# Altium schematic sheet Elreg_Sender_CH2.SchDoc
size A
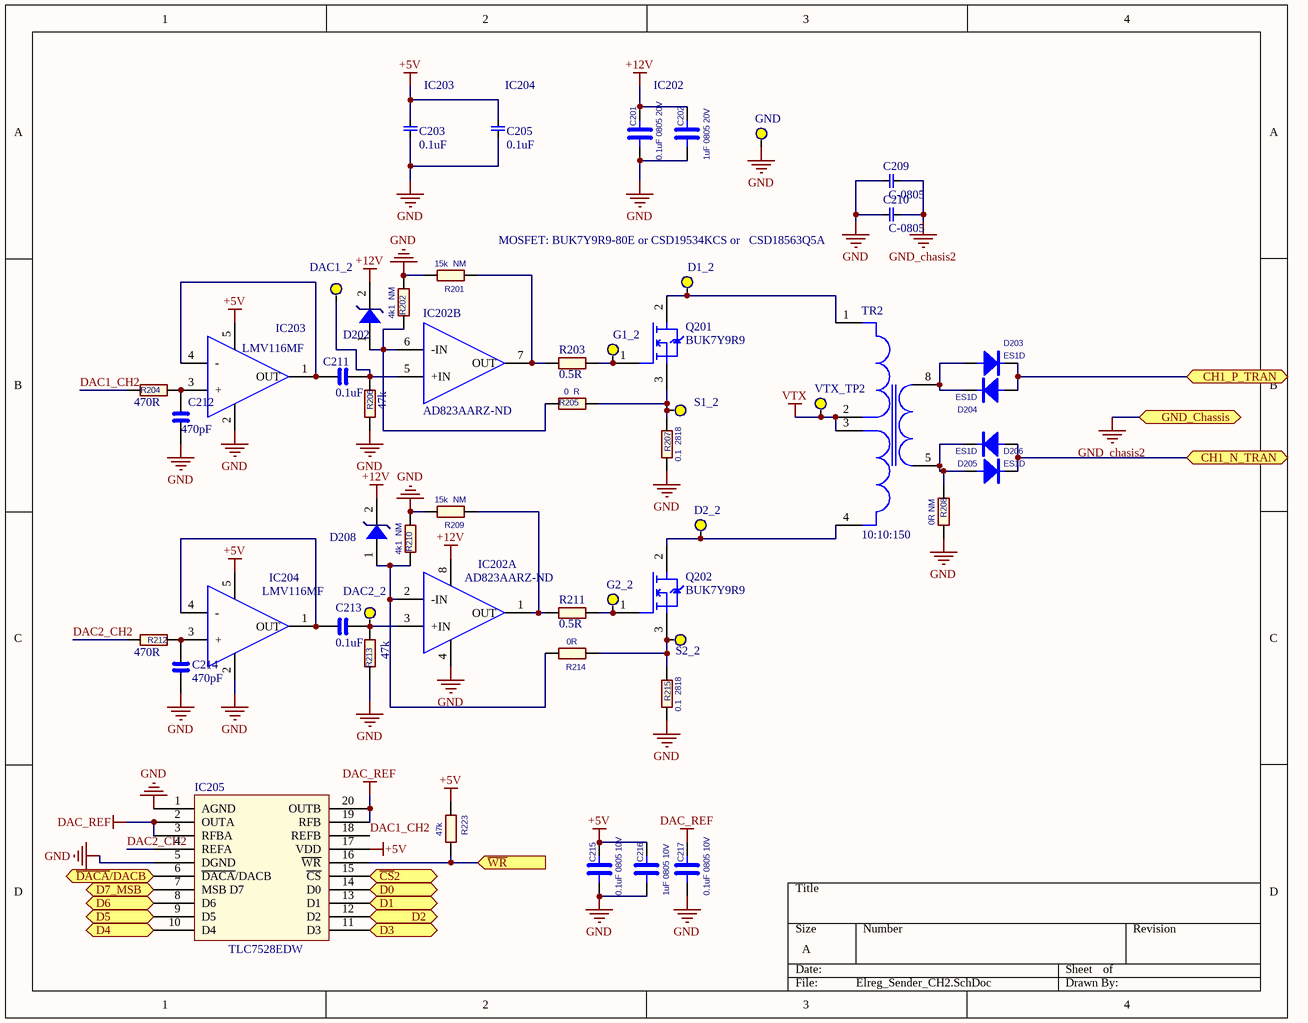
[diagram p0: Elreg_Sender_CH2.SchDoc]

## Parts
C201  0.1uF 0805 20V  [C-0603]
C202  1uF 0805 20V  [C-0603]
C203  0.1uF  [C-0603]
C205  0.1uF  [C-0603]
C209  C-0805  [C-0805]
C210  C-0805  [C-0805]
C211  0.1uF  [C-0603]
C212  470pF  [C-0603]
C213  0.1uF  [C-0603]
C214  470pF  [C-0603]
C215  0.1uF 0805 10V  [C-0603]
C216  1uF 0805 10V  [C-0603]
C217  0.1uF 0805 10V  [C-0603]
D1_2  Test_Point  [Test_Point]  (value not drawn)
D2_2  Test_Point  [Test_Point]  (value not drawn)
D202  Zener 12V  [DFN380P520X45-2N]  (value not drawn)
D203  ES1D  [SMA]
D204  ES1D  [SMA]
D205  ES1D  [SMA]
D206  ES1D  [SMA]
D208  Zener 12V  [DFN380P520X45-2N]  (value not drawn)
DAC1_2  DAC2_2  [Test_Point]  (value not drawn)
DAC2_2  DAC2_2  [Test_Point]  (value not drawn)
G1_2  Test_Point  [Test_Point]  (value not drawn)
G2_2  Test_Point  [Test_Point]  (value not drawn)
IC202  AD823AARZ-ND  [TSOP65P280X110-8N]  (parts A,B of 2)
IC203  LMV116MF  [SOT-23-5]
IC204  LMV116MF  [SOT-23-5]
IC205  TLC7528EDW  [SOIC-20]
Q201  BUK7Y9R9  [BUK7Y9R)]
Q202  BUK7Y9R9  [BUK7Y9R)]
R201  15k  NM  [R-0603]
R202  4k1  NM  [R-0603]
R203  0.5R  [R-0603]
R204  470R  [R-0603]
R205  0  R  [R-0603]
R206  47k  [R-0603]
R207  0.1  2818  [RES2818]
R208  0R NM  [RES-0805]
R209  15k  NM  [R-0603]
R210  4k1  NM  [R-0603]
R211  0.5R  [R-0603]
R212  470R  [R-0603]
R213  47k  [R-0603]
R214  0R  [R-0603]
R215  0.1  2818  [RES2818]
R223  47k  [R-0603]
S1_2  Test_Point  [Test_Point]  (value not drawn)
S2_2  Test_Point  [Test_Point]  (value not drawn)
TP6  GND  [Test_Point]
TR2  10:10:150  [Trafo_15x15]
VTX_TP2  Test_Point  [Test_Point]  (value not drawn)

## Ports
CH1_N_TRAN (bidir), CH1_P_TRAN (bidir), D0 (in), D1 (in), D2 (in), D3 (in), D4 (in), D5 (in), D6 (in), D7_MSB (in), GND_Chassis (bidir), ~{CS}2 (in), ~{DACA}/DACB (in), ~{WR} (in)

## Nets
+5V: C203.2(G) C205.2(G) C215.2 C216.2 IC203.5(+Vs) IC204.5(+Vs) IC205.17(VDD) R223.2
+12V: C201.2 C202.2 D202.2(A) D208.2(A) IC202.8(+Vs)
DAC_REF: C217.2 IC205.2(OUTA) IC205.3(RFBA) IC205.19(RFB) IC205.20(OUTB)
GND: C201.1 C202.1 C203.1(G) C205.1(G) C209.1(G) C210.1(G) C212.2 C214.1 C215.1 C216.1 C217.1 IC202.4(-Vs) IC203.2(-Vs) IC204.2(-Vs) IC205.1(AGND) IC205.5(DGND) R201.1 R202.2 R206.1 R207.2 R208.1 R209.1 R210.2 R213.2 R215.2 TP6.1
GND_chasis2: C209.2(G) C210.2(G) ; port GND_Chassis
VTX: TR2.2(G) TR2.3(G) VTX_TP2.1
~{CS}2: IC205.15(~{CS}) ; port ~{CS}2
~{DACA}/DACB: IC205.6(~{DACA}/DACB) ; port ~{DACA}/DACB
~{WR}: IC205.16(~{WR}) R223.1 ; port ~{WR}
CH1_N_TRAN: D205.1(A) D206.2(C) ; port CH1_N_TRAN
CH1_P_TRAN: D203.2(C) D204.1(A) ; port CH1_P_TRAN
D0: IC205.14(D0) ; port D0
D1: IC205.13(D1) ; port D1
D2: IC205.12(D2) ; port D2
D3: IC205.11(D3) ; port D3
D4: IC205.10(D4) ; port D4
D5: IC205.9(D5) ; port D5
D6: IC205.8(D6) ; port D6
D7_MSB: IC205.7(MSB_D7) ; port D7_MSB
DAC1_CH2: IC205.18(REFB) R204.1
DAC2_CH2: IC205.4(REFA) R212.1
NetC211_1: C211.1 DAC1_2.1 IC202.5(+IN) R206.2
NetC211_2: C211.2 IC203.1(OUT) IC203.4(-)
NetC212_1: C212.1 IC203.3(+) R204.2
NetC213_1: C213.1 DAC2_2.1 IC202.3(+IN) R213.1
NetC213_2: C213.2 IC204.1(OUT) IC204.4(-)
NetC214_2: C214.2 IC204.3(+) R212.2
NetD1_2_1: D1_2.1 Q201.2(G) TR2.1(G)
NetD2_2_1: D2_2.1 Q202.2(G) TR2.4(G)
NetD202_1: D202.1(A) IC202.6(-IN) R202.1 R205.1
NetD203_1: D203.1(A) D204.2(C) TR2.8(G)
NetD205_2: D205.2(C) D206.1(A) R208.2 TR2.5(G)
NetD208_1: D208.1(A) IC202.2(-IN) R210.1 R214.1
NetG1_2_1: G1_2.1 Q201.1(G) R203.2
NetG2_2_1: G2_2.1 Q202.1(G) R211.2
NetIC202_1: IC202.1(OUT) R209.2 R211.1
NetIC202_7: IC202.7(OUT) R201.2 R203.1
NetQ201_3: Q201.3(G) R205.2 R207.1 S1_2.1
NetQ202_3: Q202.3(G) R214.2 R215.1 S2_2.1

## Notes on the sheet
- IC203
- (near C205) IC204
- IC202
- MOSFET: BUK7Y9R9-80E or CSD19534KCS or   CSD18563Q5A

## Library data of the parts
C201 C202 C215-C217 = 0805CAPxxrrrrv: CAP CER rrrrUF xV x% type 0805
C203 C205 = C-0805_3_3uF: Manufacturer 1: Yageo; Manufacturer Part Number 1: CC1206KKX7RBBB332; Tolerance: ±10%; Voltage - Rated: 500V; Temperature Coefficient: X7R; Notification: Current market demand for these product types have resulted in fluctuating and extending lead times. Lead times may differ.; Description 1: CAP CER 3300PF 500V X7R 1206; Category 1: Capacitors; Packaging: Cut Tape (CT); Part Status: Active; Operating Temperature: -55°C ~ 125°C; Features: -; Ratings: -; Applications: General Purpose; Failure Rate: -; Mounting Type: Surface Mount, MLCC; Package / Case: 1206 (3216 Metric); Size / Dimension: 0.126" L x 0.063" W (3.20mm x 1.60mm); Height - Seated (Max): -; Thickness (Max): 0.057" (1.45mm); Lead Spacing: -; Lead Style: -; ComponentLink1URL: http://www.yageo.com/documents/recent/UPY-NP0X7R_MV_100-to-630V_21.pdf; ComponentLink1Description: http://www.yageo.com/documents/recent/UPY-NP0X7R_MV_100-to-630V_21.pdf; Supplier 1: Digi-Key; Supplier Part Number 1: 311-1506-1-ND; RoHS 1: RoHS Compliant; Stock 1: 4928; Pricing 1: 1=0.31, 10=0.214, 100=0.1085, 500=0.07424, 1000=0.06568 (USD)
C209 C210 = C-0805: Manufacturer 1: Yageo; Manufacturer Part Number 1: CC1206KKX7RBBB332; Tolerance: ±10%; Voltage - Rated: 500V; Temperature Coefficient: X7R; Notification: Current market demand for these product types have resulted in fluctuating and extending lead times. Lead times may differ.; Description 1: CAP CER 3300PF 500V X7R 1206; Category 1: Capacitors; Packaging: Cut Tape (CT); Part Status: Active; Operating Temperature: -55°C ~ 125°C; Features: -; Ratings: -; Applications: General Purpose; Failure Rate: -; Mounting Type: Surface Mount, MLCC; Package / Case: 1206 (3216 Metric); Size / Dimension: 0.126" L x 0.063" W (3.20mm x 1.60mm); Height - Seated (Max): -; Thickness (Max): 0.057" (1.45mm); Lead Spacing: -; Lead Style: -; ComponentLink1URL: http://www.yageo.com/documents/recent/UPY-NP0X7R_MV_100-to-630V_21.pdf; ComponentLink1Description: http://www.yageo.com/documents/recent/UPY-NP0X7R_MV_100-to-630V_21.pdf; Supplier 1: Digi-Key; Supplier Part Number 1: 311-1506-1-ND; RoHS 1: RoHS Compliant; Stock 1: 4928; Pricing 1: 1=0.31, 10=0.214, 100=0.1085, 500=0.07424, 1000=0.06568 (USD)
C211 C213 = C-0603_0_1u_10V: CAP CER 0.1UF 10V X7R 0603; Manufacturer Part Number: 885012206020
C212 C214 = C-0603_470p_10V: CAP CER 470p 10V C0G/NP0 0603; Manufacturer Part Number: 885012006014
D202 D208 = Zener 12V: Manufacturer 1: Comchip Technology; Manufacturer Part Number 1: CDBA140-G; Description 1: DIODE SCHOTTKY 40V 1A DO214AC; Category 1: Discrete Semiconductor Products; Diode Type: Schottky; Current - Average Rectified (Io): 1A; Speed: Fast Recovery =< 500ns, > 200mA (Io); Supplier 1: Digi-Key; Supplier Part Number 1: 641-1015-1-ND; RoHS 1: RoHS Compliant; Stock 1: 527910; Pricing 1: 1=0.37, 10=0.338, 100=0.1893, 500=0.1014, 1000=0.06895 (USD); Packaging: Cut Tape (CT); Part Status: Active; Capacitance @ Vr, F: -; Mounting Type: Surface Mount; Package / Case: DO-214AC, SMA; Supplier Device Package: DO-214AC (SMA); Operating Temperature - Junction: -65°C ~ 125°C; Base Part Number: CDBA140; ComponentLink1URL: http://www.comchiptech.com/admin/files/product/CDBA140-HF%20Thru192841.%20CDBA1100-HF%20RevB.pdf; ComponentLink1Description: http://www.comchiptech.com/admin/files/product/CDBA140-HF%20Thru192841.%20CDBA1100-HF%20RevB.pdf
D203-D206 = ES1x: Diode; Manufacturer: Fairchild/ON Semiconductor; Diode Type: Standard; Voltage - DC Reverse (Vr) (Max): 200V; Current - Average Rectified (Io): 1A; Voltage - Forward (Vf) (Max) @ If: 920mV @ 1A; Speed: Fast Recovery =< 500ns, > 200mA (Io); Reverse Recovery Time (trr): 15ns; Current - Reverse Leakage @ Vr: 5μA @ 200V; Capacitance @ Vr, F: 7pF @ 4V, 1MHz; Supplier 1: Digi-Key; Supplier Part Number 1: ES1DFSTR-ND; Manufacturer Part Number: ES1D; RoHS: RoHS Compliant; Category: Discrete Semiconductor Products; Stock 1: 135000; Pricing 1: 7500=0.0567, 15000=0.0504, 37500=0.04725, 52500=0.0419, 187500=0.04032 (USD); Packaging: Tape & Reel (TR); Part Status: Active; Mounting Type: Surface Mount; Package / Case: DO-214AC, SMA; Supplier Device Package: SMA (DO-214AC); Operating Temperature - Junction: -55°C ~ 150°C; ComponentLink1URL: https://www.fairchildsemi.com/datasheets/ES/ES1A.pdf; ComponentLink1Description: https://www.fairchildsemi.com/datasheets/ES/ES1A.pdf
DAC1_2 DAC2_2 TP6 = Test_Point
IC202 = AD823AARZ-ND: IC OPAMP JFET 16MHZ RRO 8-MSOP; Supplier 1: Digi-Key; Supplier Part Number 1: AD823ARZ-ND
R201 R202 R205 R208-R210 R214 R223 = CRCW0805xxxxJN Default: RES xx OHM 1/8W 5% 0805 SMD; Category 1: Resistors
R203 R211 = RES-0805
R204 R212 = R-0603_470R: RES SMD 470 OHM 1% 0.4W 0805; Manufacturer 1: Vishay Dale; Manufacturer Part Number 1: CRCW0805150RJNEA; Manufacturer Part Number: ESR10EZPF1001; Description 1: RES 150 OHM 1/8W 5% 0805 SMD; Category 1: Resistors; Tolerance: ±5%; Power (Watts): 0.125W, 1/8W; Temperature Coefficient: ±200ppm/°C; Description 2: Thick Film Resistors - SMD 1/8watt 150ohms 5% 200ppm; Category 2: Thick Film Resistors - SMD; Power Rating: 125 mW (1/8 W); Resistance: 150 Ohms; Voltage Rating: 150 V; Description 3: VISHAY DALE - CRCW0805150RJNEA - RESISTOR, THICK FILM, 150 OHM, 125mW, 5%; Product Range: VISHAY - CRCW Series; Resistance Tolerance: ± 5%; Resistor Case Style: 0805 ^2012 Metric]; Resistor Element Type: Thick Film; No. of Pins: 2; Resistance (Ohms): 150; Supplier 1: Digi-Key; Supplier Part Number 1: 541-150ADKR-ND; RoHS 1: RoHS Compliant; Packaging: Digi-Reel®; Composition: Thick Film; Features: Automotive AEC-Q200 Qualified; Package / Case: 0805 (2012 Metric); Supplier Device Package: 0805 (2012 Metric); Size / Dimension: 0.079" L x 0.049" W (2.00mm x 1.25mm); Height: 0.020" (0.50mm); ComponentLink1URL: http://www.vishay.com/doc?20035; ComponentLink1Description: http://www.vishay.com/doc?20035; Supplier 2: Mouser; Supplier Part Number 2: 71-CRCW0805150RJNEA; Manufacturer 2: Vishay; Manufacturer Part Number 2: CRCW0805150RJNEA; RoHS 2: RoHS Compliant By Exemption; Dimensions: 1.25 mm W x 2 mm L x 0.45 mm H; Operating Temperature Range: - 55 C to + 155 C; Product: Thick Film Resistors SMD; Series: CRCW; Termination Style: SMD/SMT; Case Code - in: 0805; Case Code - mm: 2012; Product Category: 0805 Thick Film Chip Resistors; Standard Pack Qty: 5000; RoHS - Mouser: E; Minimum Order Quantity: 1; Reeling: True; ComponentLink2URL: http://www.mouser.com/ds/2/427/dcrcwe3-109170.pdf; ComponentLink2Description: http://www.mouser.com/ds/2/427/dcrcwe3-109170.pdf; Supplier 3: Farnell; Supplier Part Number 3: 1514819; Manufacturer 3: VISHAY DALE; Manufacturer Part Number 3: CRCW0805150RJNEA; RoHS 3: YES; ComponentLink3URL: http://www.farnell.com/cad/1552534.zip; ComponentLink3Description: http://www.farnell.com/cad/1552534.zip
R206 R213 = R-0603_47k: RES SMD 47k 1% 0.4W 0805; Manufacturer 1: Vishay Dale; Manufacturer Part Number 1: CRCW0805150RJNEA; Manufacturer Part Number: ESR10EZPF1001; Description 1: RES 150 OHM 1/8W 5% 0805 SMD; Category 1: Resistors; Tolerance: ±5%; Power (Watts): 0.125W, 1/8W; Temperature Coefficient: ±200ppm/°C; Description 2: Thick Film Resistors - SMD 1/8watt 150ohms 5% 200ppm; Category 2: Thick Film Resistors - SMD; Power Rating: 125 mW (1/8 W); Resistance: 150 Ohms; Voltage Rating: 150 V; Description 3: VISHAY DALE - CRCW0805150RJNEA - RESISTOR, THICK FILM, 150 OHM, 125mW, 5%; Product Range: VISHAY - CRCW Series; Resistance Tolerance: ± 5%; Resistor Case Style: 0805 ^2012 Metric]; Resistor Element Type: Thick Film; No. of Pins: 2; Resistance (Ohms): 150; Supplier 1: Digi-Key; Supplier Part Number 1: 541-150ADKR-ND; RoHS 1: RoHS Compliant; Packaging: Digi-Reel®; Composition: Thick Film; Features: Automotive AEC-Q200 Qualified; Package / Case: 0805 (2012 Metric); Supplier Device Package: 0805 (2012 Metric); Size / Dimension: 0.079" L x 0.049" W (2.00mm x 1.25mm); Height: 0.020" (0.50mm); ComponentLink1URL: http://www.vishay.com/doc?20035; ComponentLink1Description: http://www.vishay.com/doc?20035; Supplier 2: Mouser; Supplier Part Number 2: 71-CRCW0805150RJNEA; Manufacturer 2: Vishay; Manufacturer Part Number 2: CRCW0805150RJNEA; RoHS 2: RoHS Compliant By Exemption; Dimensions: 1.25 mm W x 2 mm L x 0.45 mm H; Operating Temperature Range: - 55 C to + 155 C; Product: Thick Film Resistors SMD; Series: CRCW; Termination Style: SMD/SMT; Case Code - in: 0805; Case Code - mm: 2012; Product Category: 0805 Thick Film Chip Resistors; Standard Pack Qty: 5000; RoHS - Mouser: E; Minimum Order Quantity: 1; Reeling: True; ComponentLink2URL: http://www.mouser.com/ds/2/427/dcrcwe3-109170.pdf; ComponentLink2Description: http://www.mouser.com/ds/2/427/dcrcwe3-109170.pdf; Supplier 3: Farnell; Supplier Part Number 3: 1514819; Manufacturer 3: VISHAY DALE; Manufacturer Part Number 3: CRCW0805150RJNEA; RoHS 3: YES; ComponentLink3URL: http://www.farnell.com/cad/1552534.zip; ComponentLink3Description: http://www.farnell.com/cad/1552534.zip
R207 R215 = CRCW0805xxxxJN Default: 0.1Ohm 10W; Manufacturer part number:: WSHP2818R1000FEB
TR2 = TRAFO_15x15: Coil Forme: B66414B6008T001; Yoke: B66414B2000X000; Cover Plate: B66414A7000X000; link PDF: https://www.tdk-electronics.tdk.com/inf/80/db/fer/efd_15_8_5.pdf